# EAGLE design preamp-buffer-supreme-v2 (EAGLE 7.5.0)
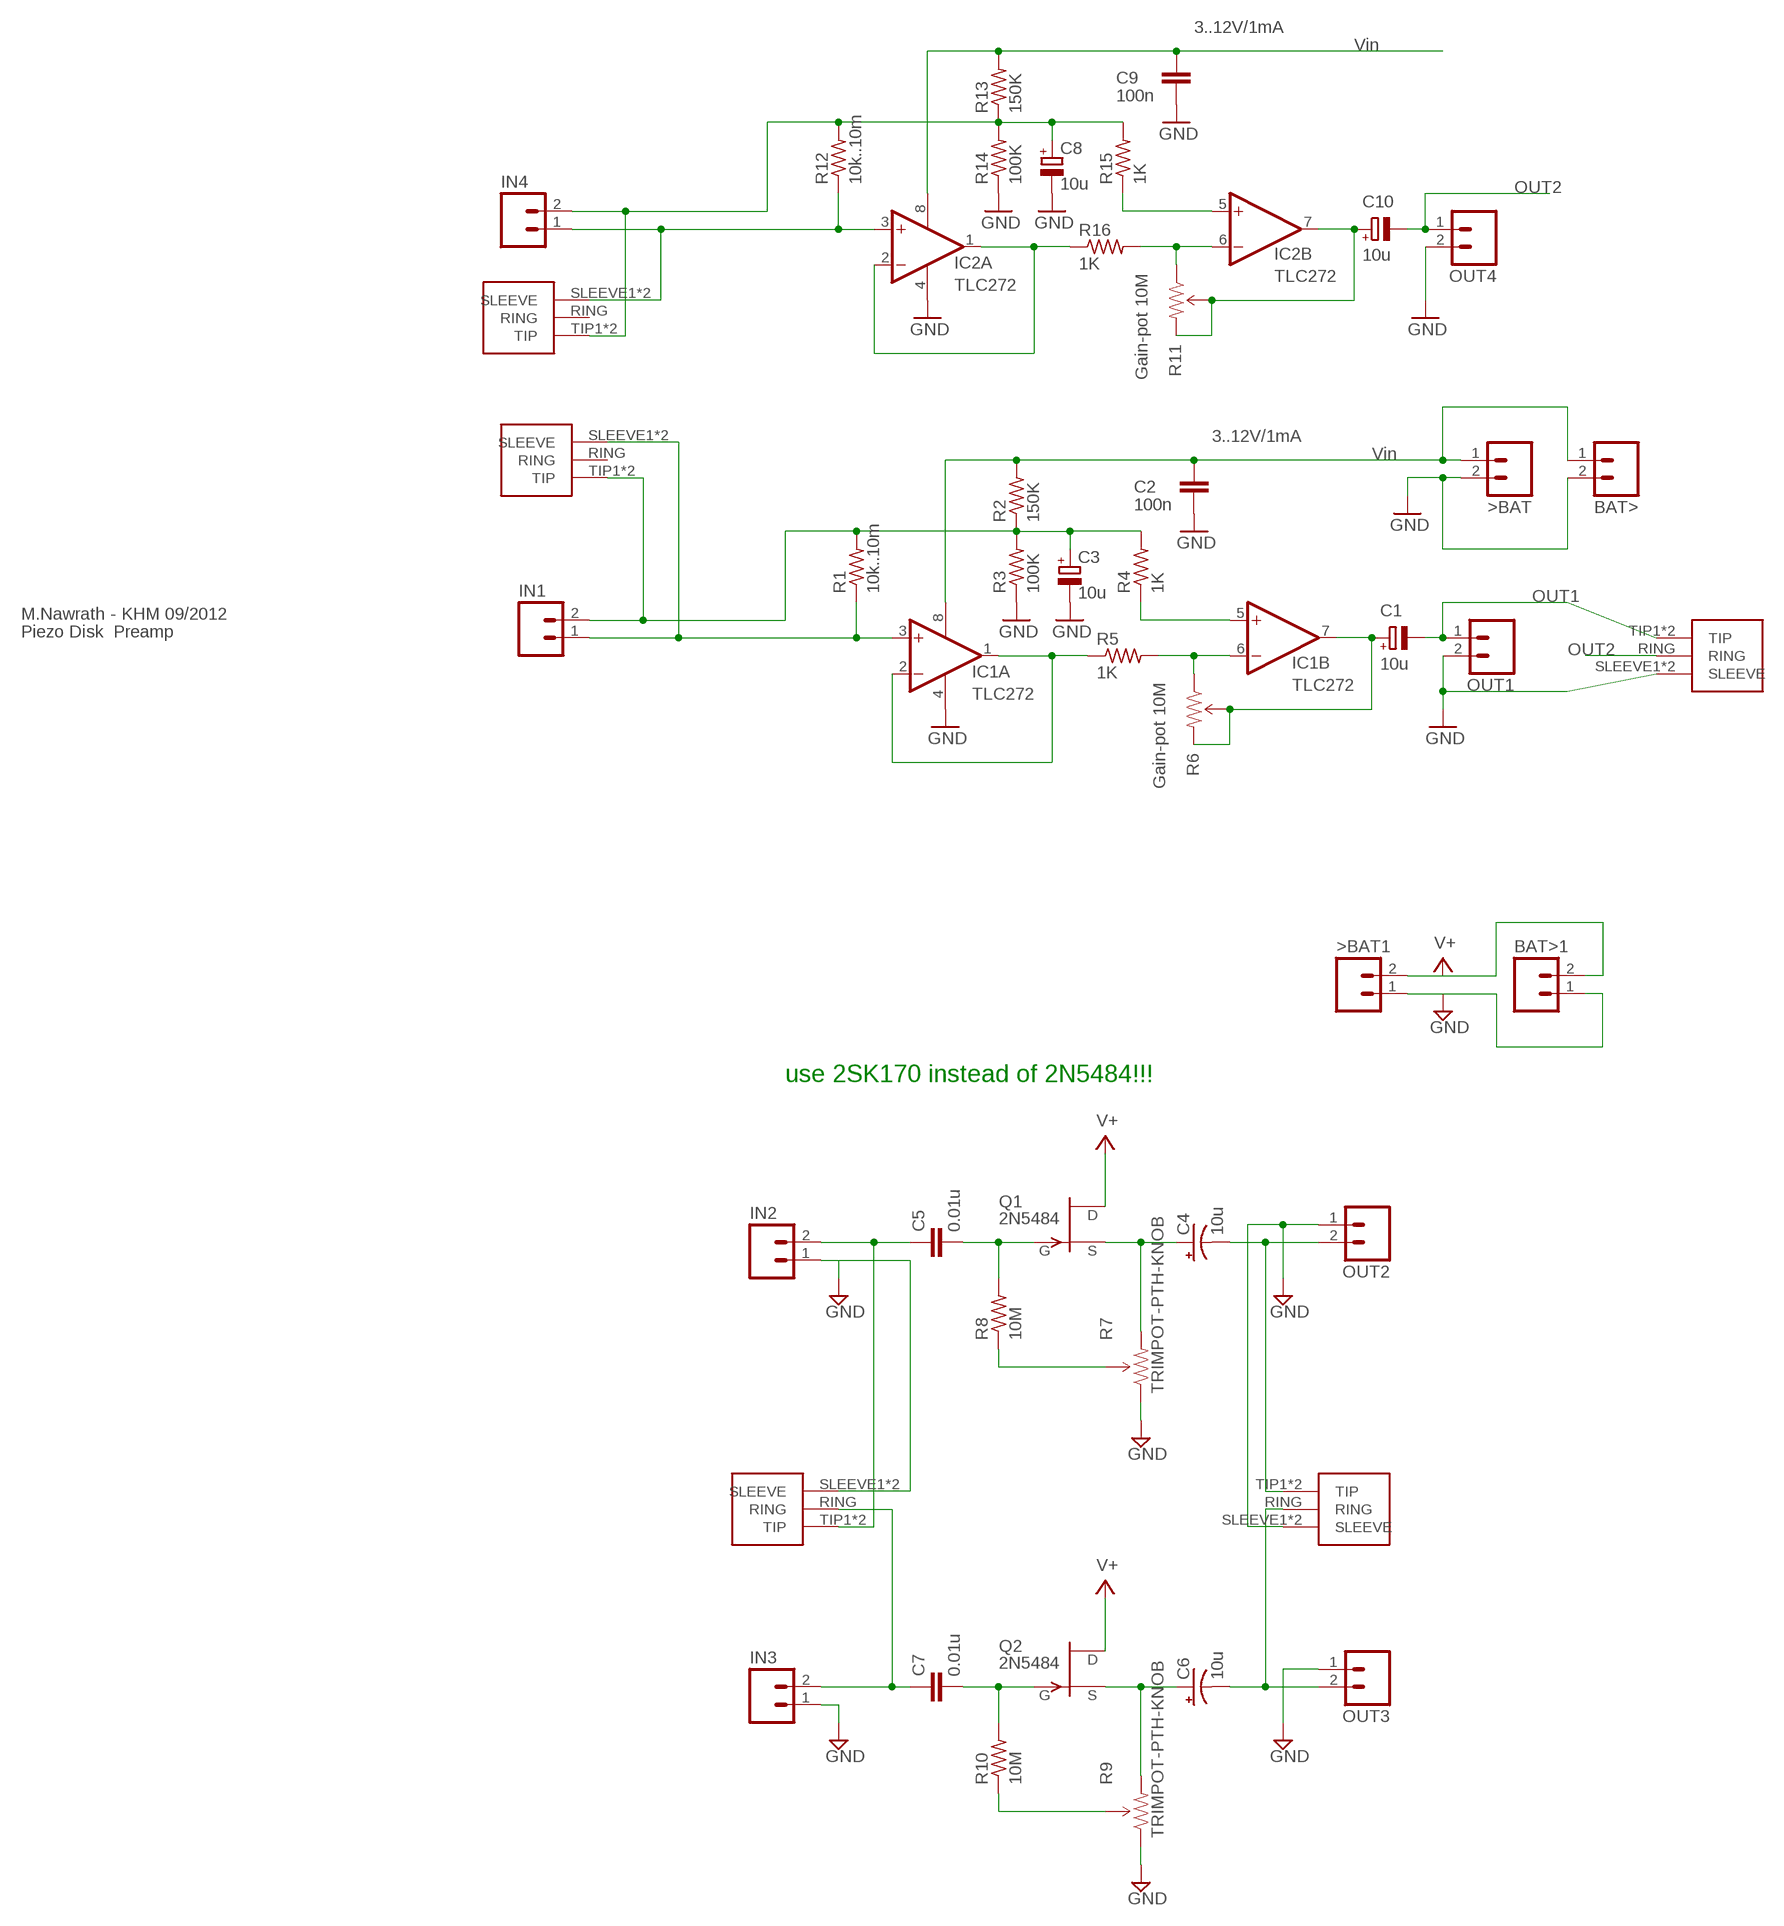
[diagram p0: schematic, sheet 1]

## Parts
>BAT  M02LOCK  [1X02_LOCK]
>BAT1  M02PTH  [1X02]
BAT>  M02LOCK  [1X02_LOCK]
BAT>1  M02PTH  [1X02]
C1  10u  CPOL-EUE2.5-5  [E2,5-5]
C2  100n  C-EU025-025X050  [C025-025X050]
C3  10u  CPOL-EUE2.5-5  [E2,5-5]
C4  10u  CAP_POLPTH2  [CPOL-RADIAL-10UF-25V]
C5  0.01u  C5/3  [C5B3]
C6  10u  CAP_POLPTH2  [CPOL-RADIAL-10UF-25V]
C7  0.01u  C5/3  [C5B3]
C8  10u  CPOL-EUE2.5-5  [E2,5-5]
C9  100n  C-EU025-025X050  [C025-025X050]
C10  10u  CPOL-EUE2.5-5  [E2,5-5]
IC1  TLC272  TLC272P  [DIL08]
IC2  TLC272  TLC272P  [DIL08]
IN1  M02LOCK  [1X02_LOCK]
IN2  M02LOCK  [1X02_LOCK]
IN3  M02LOCK  [1X02_LOCK]
IN4  M02LOCK  [1X02_LOCK]
OUT1  M02LOCK  [1X02_LOCK]
OUT1-TRS  1/8"-F-STEREO-PCB  [1/8"-F-STEREO-PCB]
OUT2  M02LOCK  [1X02_LOCK]
OUT3  M02LOCK  [1X02_LOCK]
OUT4  M02LOCK  [1X02_LOCK]
Q1  2N5484  [TO92-]
Q2  2N5484  [TO92-]
R1  10k..10m  R-US_0204/2V  [0204V]
R2  150K  R-US_0204/2V  [0204V]
R3  100K  R-US_0204/2V  [0204V]
R4  1K  R-US_0204/2V  [0204V]
R5  1K  R-US_0204/2V  [0204V]
R6  Gain-pot 10M  TRIMPOT-PTH-KNOB  [3386U]
R7  TRIMPOT-PTH-KNOB  [3386U]
R8  10M  R-US_0204/2V  [0204V]
R9  TRIMPOT-PTH-KNOB  [3386U]
R10  10M  R-US_0204/2V  [0204V]
R11  Gain-pot 10M  TRIMPOT-PTH-KNOB  [3386U]
R12  10k..10m  R-US_0204/2V  [0204V]
R13  150K  R-US_0204/2V  [0204V]
R14  100K  R-US_0204/2V  [0204V]
R15  1K  R-US_0204/2V  [0204V]
R16  1K  R-US_0204/2V  [0204V]
U$1  1/8"-F-STEREO-PCB  [1/8"-F-STEREO-PCB]
U$2  1/8"-F-STEREO-PCB  [1/8"-F-STEREO-PCB]
U$3  1/8"-F-STEREO-PCB  [1/8"-F-STEREO-PCB]
U$4  1/8"-F-STEREO-PCB  [1/8"-F-STEREO-PCB]

## Nets
CH1: C4.2(-) OUT2.2 U$1.TIP1(TIP) U$1.TIP2(TIP)
CH2: C6.2(-) OUT3.2 U$1.RING
GND: >BAT1.1 >BAT.2 BAT>1.1 BAT>.2 C2.1 C3.- C8.- C9.1 IC1.4(P:V-) IC2.4(P:V-) IN2.1 IN3.1 OUT1-TRS.SLEEVE1(SLEEVE) OUT1-TRS.SLEEVE2(SLEEVE) OUT1.2 OUT2.1 OUT3.1 OUT4.2 R3.1 R7.1(CCW) R9.1(CCW) R14.1 U$1.SLEEVE1(SLEEVE) U$1.SLEEVE2(SLEEVE) U$3.SLEEVE1(SLEEVE) U$3.SLEEVE2(SLEEVE)
JFET-GATE: C5.2 Q1.1(G) R8.2
JFET-GATE1: C7.2 Q2.1(G) R10.2
JFET-SOURCE: C4.1(+) Q1.2(S) R7.3(CW)
JFET-SOURCE1: C6.1(+) Q2.2(S) R9.3(CW)
N$1: C3.+ IN1.2 R1.2 R2.1 R3.2 R4.2 U$2.TIP1(TIP) U$2.TIP2(TIP)
N$2: IC1.6(B:-IN) R5.2 R6.1(CCW)
N$4: R7.2(WIPER) R8.1
N$5: IC1.5(B:+IN) R4.1
N$6: C1.+ IC1.7(B:OUT) R6.2(WIPER) R6.3(CW)
N$7: C5.1 IN2.2 U$3.TIP1(TIP) U$3.TIP2(TIP)
N$8: IC1.3(A:+IN) IN1.1 R1.1 U$2.SLEEVE1(SLEEVE) U$2.SLEEVE2(SLEEVE)
N$9: R9.2(WIPER) R10.1
N$10: C7.1 IN3.2 U$3.RING
N$11: IC2.1(A:OUT) IC2.2(A:-IN) R16.1
N$13: IC2.5(B:+IN) R15.1
N$14: IC1.1(A:OUT) IC1.2(A:-IN) R5.1
N$15: C10.+ IC2.7(B:OUT) R11.2(WIPER) R11.3(CW)
N$16: IC2.6(B:-IN) R11.1(CCW) R16.2
N$17: C8.+ IN4.2 R12.2 R13.1 R14.2 R15.2 U$4.TIP1(TIP) U$4.TIP2(TIP)
N$18: IC2.3(A:+IN) IN4.1 R12.1 U$4.SLEEVE1(SLEEVE) U$4.SLEEVE2(SLEEVE)
OUT1: C1.- OUT1-TRS.TIP1(TIP) OUT1-TRS.TIP2(TIP) OUT1.1
OUT2: C10.- OUT1-TRS.RING OUT4.1
V+: >BAT1.2 BAT>1.2 Q1.3(D) Q2.3(D)
VIN: >BAT.1 BAT>.1 C2.2 C9.2 IC1.8(P:V+) IC2.8(P:V+) R2.2 R13.2
Unconnected: U$2.RING U$4.RING

## Notes on the sheet
- 3..12V/1mA
- Vin
- OUT2
- 3..12V/1mA
- Vin
- OUT1
- M.Nawrath - KHM 09/2012
- Piezo Disk  Preamp
- OUT2
- use 2SK170 instead of 2N5484!!!

## Library data of the parts
>BAT >BAT1 BAT> BAT>1 IN1-IN4 OUT1-OUT4 = SparkFun-Connectors:M02: Header 2 Standard 2-pin 0.1" header. Use with straight break away headers (SKU : PRT-00116), right angle break away headers (PRT-00553), swiss pins (PRT-00743), machine pins (PRT-00117), and female headers (PRT-00115). Molex polarized connector foot print use with SKU : PRT-08233 with associated crimp pins and housings.
C1 C3 C8 C10 = rcl:CPOL-EU: POLARIZED CAPACITOR, European symbol
C2 C9 = rcl:C-EU: CAPACITOR, European symbol
C4 C6 = SparkFun-Passives:CAP_POL: Capacitor Polarized These are standard SMD and PTH capacitors. Normally 10uF, 47uF, and 100uF in electrolytic and tantalum varieties. Always verify the external diameter of the through hole cap, it varies with capacity, voltage, and manufacturer. The EIA devices should be standard.
C5 C7 = capacitor-wima:C: CAPACITOR naming: grid - package width
IC1 IC2 = linear:TLC272: OP AMP
OUT1-TRS U$1-U$4 = CMU-ArtFab:1/8"-F-STEREO-PCB
Q1 Q2 = transistor-fet:?548*: N-Channel JFETs Source: VISHAY 2N5484.pdf Compatible: TO92 2N5245 J304 J305 U310 J308 J309 J310 TO72 2N4416 2N4416A 2N3823 2N4351 3N169 3N170 3N171 MFE3002 TO18 2N3796 2N3797 MFE825 Source: Motorola European Master Guide Pacge 3-59
R1-R5 R8 R10 R12-R16 = resistor:R-US_: RESISTOR, American symbol
R6 R7 R9 R11 = SparkFun-Electromechanical:TRIMPOT: Various small potentiometers for "set-and-forget" applications

## Board
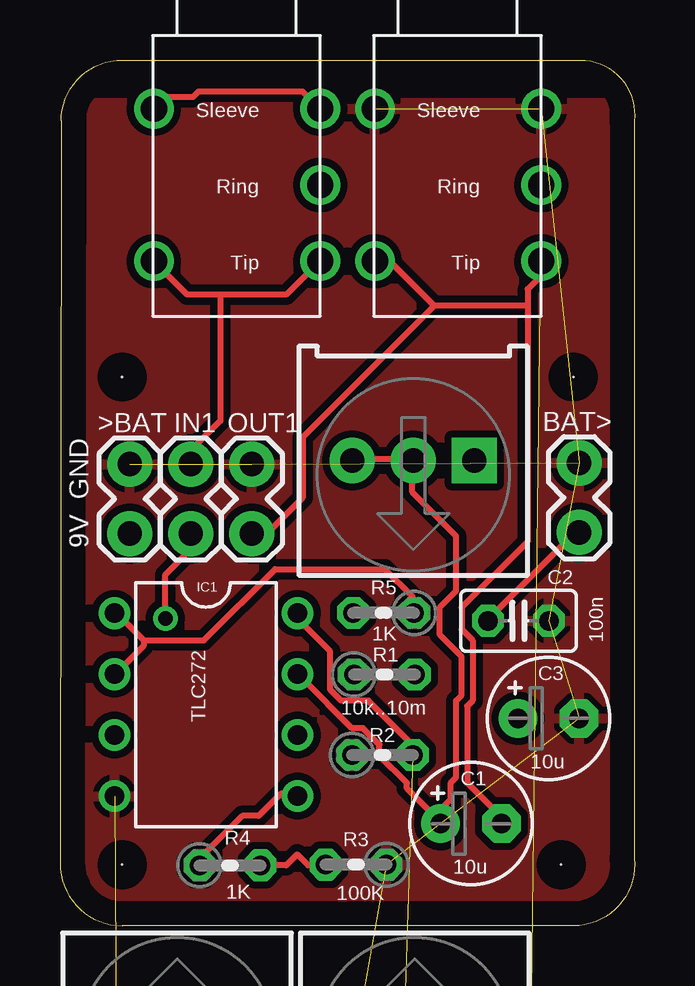
[diagram p1: board, top side]
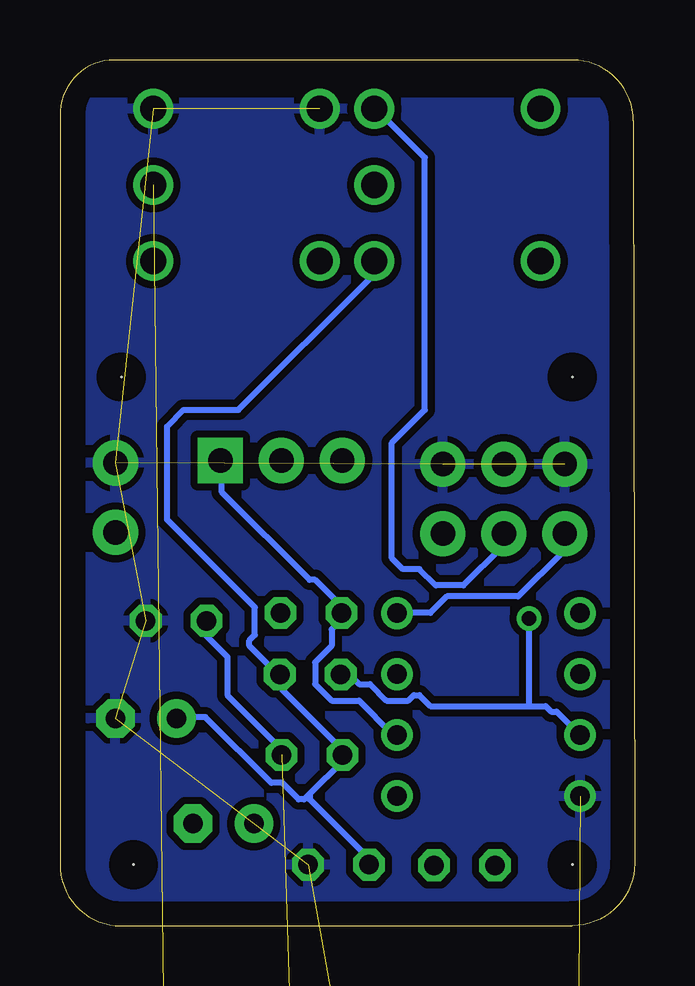
[diagram p2: board, bottom side, seen from below]

Size 23.94 x 36.07 mm. Coordinates in mm from the lower left corner, seen from the top.
Outline: 0.05,33.53 arc-90 2.59,36.07 21.89,36.07 arc-90 23.93,33.53 23.93,2.79 arc-90 21.64,0 2.59,0 arc-90 0,2.59 0.05,33.53
Copper layers (1*16): Top 0.035mm / dielectric 1.5mm / Bottom 0.035mm
Design rules "default": minimum track width 10mil, minimum drill 24mil, track to track 8mil, track to pad 8mil, pad to pad 8mil, via to via 8mil, smd to smd 8mil, copper to edge 40mil, drill to drill 8mil, minimum pad ring 10mil, minimum via ring 8mil, stop-mask expansion 4mil, vias tented up to drill 0mil, thermal gap 10mil
Holes 0 mm at 2.59,22.86 21.39,22.86 2.59,2.54 20.88,2.54

### Footprints (pad centres in the part's own frame; a part is rotated, then mirrored left to right if it is on the bottom)
1X02_LOCK = drill 1.016 pad 1.88: 1 -0.178,0; 2 2.718,0
1X02 = drill 1.016 pad 1.88: 1 0,0; 2 2.54,0
E2,5-5 = drill 0.813 pad 1.6: + -1.27,0 | drill 0.813 pad 1.6 octagon: - 1.27,0
C025-025X050 = drill 0.813 octagon: 1 -1.27,0; 2 1.27,0
CPOL-RADIAL-10UF-25V = drill 0.7 pad 1.651 square: 1 1.27,0 | drill 0.7 pad 1.651: 2 -1.27,0
C5B3 = drill 0.813 pad 1.6 octagon: 1 -2.54,0; 2 2.54,0
DIL08 = drill 0.813 pad 1.27: 1 -3.81,-3.81; 2 -1.27,-3.81; 3 1.27,-3.81; 4 3.81,-3.81; 5 3.81,3.81; 6 1.27,3.81; 7 -1.27,3.81; 8 -3.81,3.81
1/8"-F-STEREO-PCB = drill 1.1: RING 5.461,0; SLEEVE1 8.636,6.934; SLEEVE2 8.636,0; TIP1 2.286,6.934; TIP2 2.286,0
TO92- = drill 0.813 long: 1 2.54,0; 2 0,0; 3 -2.54,0
0204V = drill 0.813 octagon: 1 -1.27,0; 2 1.27,0
3386U = drill 1.016 pad 1.88 square: 1 -2.54,-0.015 | drill 1.016 pad 1.88: 2 0,-0.015; 3 2.54,-0.015

### Placement (x,y rotation side)
>BAT  2.91,16.51 90 top
>BAT1  1.83,-38.35 0 top  (outside the outline)
BAT>  21.63,16.56 90 top
BAT>1  8.69,-38.35 0 top  (outside the outline)
C1  17.13,4.25 0 top
C2  19.1,12.7 180 top
C3  20.36,8.64 0 top
C4  10.46,-30.48 0 top  (outside the outline)
C5  21.13,-22.61 0 top  (outside the outline)
C6  15.8,-30.48 0 top  (outside the outline)
C7  3.86,-31.24 0 top  (outside the outline)
C8  8.43,-66.8 0 top  (outside the outline)
C9  2.84,-67.06 0 top  (outside the outline)
C10  17.58,-66.8 0 top  (outside the outline)
IC1  6.08,9.21 270 top
IC2  16.81,-49.78 0 top  (outside the outline)
IN1  5.45,16.51 90 top
IN2  15.54,-38.35 0 top  (outside the outline)
IN3  21.39,-38.35 0 top  (outside the outline)
IN4  20.62,-79.76 0 top  (outside the outline)
OUT1  7.99,16.51 90 top
OUT1-TRS  20.05,25.4 90 top
OUT2  27.23,-38.35 0 top  (outside the outline)
OUT3  1.83,-43.43 0 top  (outside the outline)
OUT4  26.47,-79.76 0 top  (outside the outline)
Q1  3.61,-23.88 0 top  (outside the outline)
Q2  12.24,-23.88 0 top  (outside the outline)
R1  13.51,10.46 0 top
R2  13.44,7.11 0 top
R3  12.33,2.54 180 top
R4  7.09,2.51 0 top
R5  13.49,13.03 180 top
R6  14.72,19.37 180 top
R7  4.88,-5.08 0 top  (outside the outline)
R8  21.13,-30.73 0 top  (outside the outline)
R9  14.78,-5.08 0 top  (outside the outline)
R10  26.21,-30.73 0 top  (outside the outline)
R11  4.88,-49.78 0 top  (outside the outline)
R12  2.59,-73.41 0 top  (outside the outline)
R13  11.73,-73.41 0 top  (outside the outline)
R14  17.58,-73.41 0 top  (outside the outline)
R15  23.42,-73.41 0 top  (outside the outline)
R16  2.59,-79.25 0 top  (outside the outline)
U$1  1.07,-18.03 0 top  (outside the outline)
U$2  10.85,25.4 90 top
U$3  16.05,-18.03 0 top  (outside the outline)
U$4  16.05,-62.74 0 top  (outside the outline)

### Tracks (layer width: path | path; a pad name or v marks a point on that pad's centre or on a via)
CH1  (3 unrouted)
CH2  (2 unrouted)
GND  (25 unrouted)
  pour Bottom (isolate 0.305): 1,34.29 22.91,34.29 22.72,0.95 1.08,0.95
  pour Top (isolate 0.305): 1,34.29 22.91,34.29 22.72,0.95 1,1.05
JFET-GATE  (2 unrouted)
JFET-GATE1  (2 unrouted)
JFET-SOURCE  (2 unrouted)
JFET-SOURCE1  (2 unrouted)
N$1
  Top 0.254: U$2.TIP1 5.31,26.29 6.68,26.29 | 6.68,26.29 9.42,26.29 10.79,27.66 U$2.TIP2 | 6.68,26.29 6.68,21.03 5.54,19.89 5.54,19.43 IN1.2 | R4.2 9.42,2.52 9.88,2.97 10.34,2.52 11.02,2.52 R3.2
  Bottom 0.254: 13.54,5.49 12.17,6.86 R2.1 12.17,7.32 14.68,9.83 14.68,10.29 R1.2 14.91,10.52 16.05,11.66 16.05,11.89 15.82,12.12 15.82,13.26 19.48,16.92 19.48,20.8 18.8,21.49 16.51,21.49 11.02,26.98 11.02,27.66 U$2.TIP2 | 13.54,5.49 13.77,5.26 14,5.26 14.68,5.94 15.14,5.94 17.88,8.69 19.02,8.69 C3.+ | 13.54,5.49 13.54,5.26 11.25,2.97 11.25,2.74 R3.2
N$2
  Bottom 0.254: 12.39,13.03 12.39,12.57 12.62,12.34 12.62,11.66 13.31,10.97 13.31,10.06 12.62,9.37 11.48,9.37 10.11,8 IC1.6 | 12.39,13.03 12.39,13.49 13.31,14.4 13.54,14.4 17.2,18.06 17.2,19.2 R6.1 | 12.39,13.03 R5.2
N$4  (1 unrouted)
N$5
  Top 0.254: R4.1 5.99,2.52 5.99,2.97 7.59,4.57 8.28,4.57 9.19,5.49 9.88,5.49 IC1.5
N$6
  Top 0.254: R6.3 12.39,19.43 14.68,19.43 R6.2 14.68,19.2 14.68,18.06 16.51,16.23 16.51,13.95 15.82,13.26 15.82,12.12 16.74,11.2 16.74,9.6 16.51,9.37 16.51,6.17 16.28,5.94 16.28,5.26 15.6,4.57 | 15.6,4.57 15.82,4.34 C1.+ 15.6,4.57 | 15.6,4.57 14.45,5.71 14.45,5.94 13.31,7.09 13.31,7.54 12.62,8.23 12.17,8.23 10.11,10.29 IC1.7
N$7  (3 unrouted)
N$8  (via drill 0.61)
  Top 0.254: U$2.SLEEVE1 4.39,34.52 5.54,34.52 5.77,34.75 10.11,34.75 10.79,34.06 U$2.SLEEVE2 | v4.39,12.8 4.39,14.63 5.31,15.54 5.31,16.23 IN1.1
  Bottom 0.254: IC1.3 3.25,8.91 3.48,8.91 3.71,9.14 4.39,9.14 | 4.39,9.14 8.51,9.14 8.97,9.6 9.19,9.6 9.42,9.37 10.34,9.37 11.02,10.06 11.48,10.06 11.71,10.29 12.17,10.29 R1.1 | 4.39,9.14 v4.39,12.8 | U$2.SLEEVE2 10.79,33.83 10.57,33.83 8.74,32 8.74,21.49 10.11,20.12 10.11,15.32 9.65,14.86 8.97,14.86 8.28,14.17 7.14,14.17 5.54,15.77 5.54,16.23 IN1.1
N$9  (1 unrouted)
N$10  (2 unrouted)
N$11  (2 unrouted)
N$13  (1 unrouted)
N$14
  Top 0.254: 3.48,11.89 3.48,11.66 2.34,10.52 IC1.2 | 3.48,11.89 2.34,13.03 IC1.1 | 3.48,11.89 5.99,11.89 8.97,14.86 13.54,14.86 14.68,13.72 14.68,13.03 R5.1
N$15  (3 unrouted)
N$16  (2 unrouted)
N$17  (7 unrouted)
N$18  (4 unrouted)
OUT1
  Top 0.254: 19.48,25.83 19.48,26.52 19.94,26.98 19.94,27.66 OUT1-TRS.TIP2 | 19.48,25.83 19.48,16 16.74,13.26 16.74,12.34 17.2,11.89 17.2,9.37 16.97,9.14 16.97,5.94 18.34,4.57 18.34,4.34 C1.- | 15.6,25.83 13.77,27.66 13.31,27.66 OUT1-TRS.TIP1 | 19.48,25.83 15.6,25.83 | 15.6,25.83 10.11,20.34 10.11,17.83 8.74,16.46 8.05,16.46 OUT1.1
OUT2  (2 unrouted)
V+  (3 unrouted)
VIN  (3 unrouted)
  Top 0.254: BAT>.1 21.54,16.23 21.31,16.23 17.88,12.8 C2.2 | IC1.8 10.11,12.8 10.11,12.57 11.25,11.43 11.25,9.83 11.71,9.37 12.85,9.37 14.91,7.32 R2.2
  Bottom 0.254: IC1.8 8.51,13.03 7.82,13.72 4.85,13.72 3.02,15.54 3.02,16.23 >BAT.1 | R2.2 14.91,7.32 14.91,7.54 16.97,9.6 16.97,11.2 17.88,12.12 17.88,12.57 C2.2

### Text on the board
tNames: GND | 9V